# Altium schematic sheet Pill_Battery_Flex.SchDoc
size A
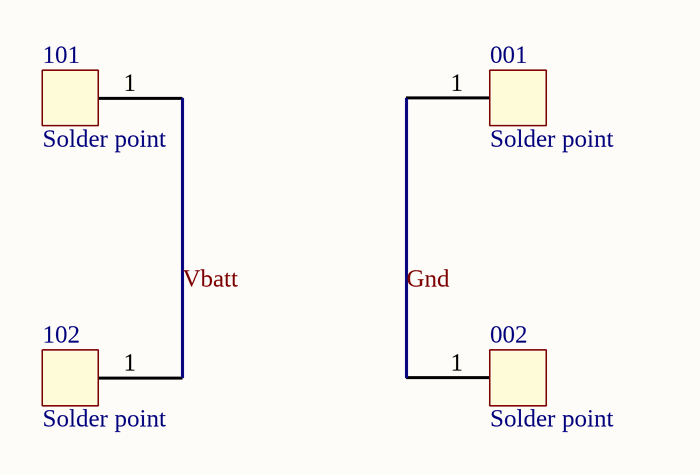
[diagram p0: Pill_Battery_Flex.SchDoc]

## Parts
001  Solder point  [Pill_Flex_Via]  (no BOM)
002  Solder point  [Pill_Flex_Via]
101  Solder point  [Pill_Flex_Via]
102  Solder point  [Pill_Flex_Via]

## Nets
Gnd: 001.1 002.1
Vbatt: 101.1 102.1

## Library data of the parts
001 = Pill_flex_pad: Gnd_boardside
002 = Pill_flex_pad: Gnd_battside
101 = Pill_flex_pad: Vbatt_boardside
102 = Pill_flex_pad: Vbatt_battside